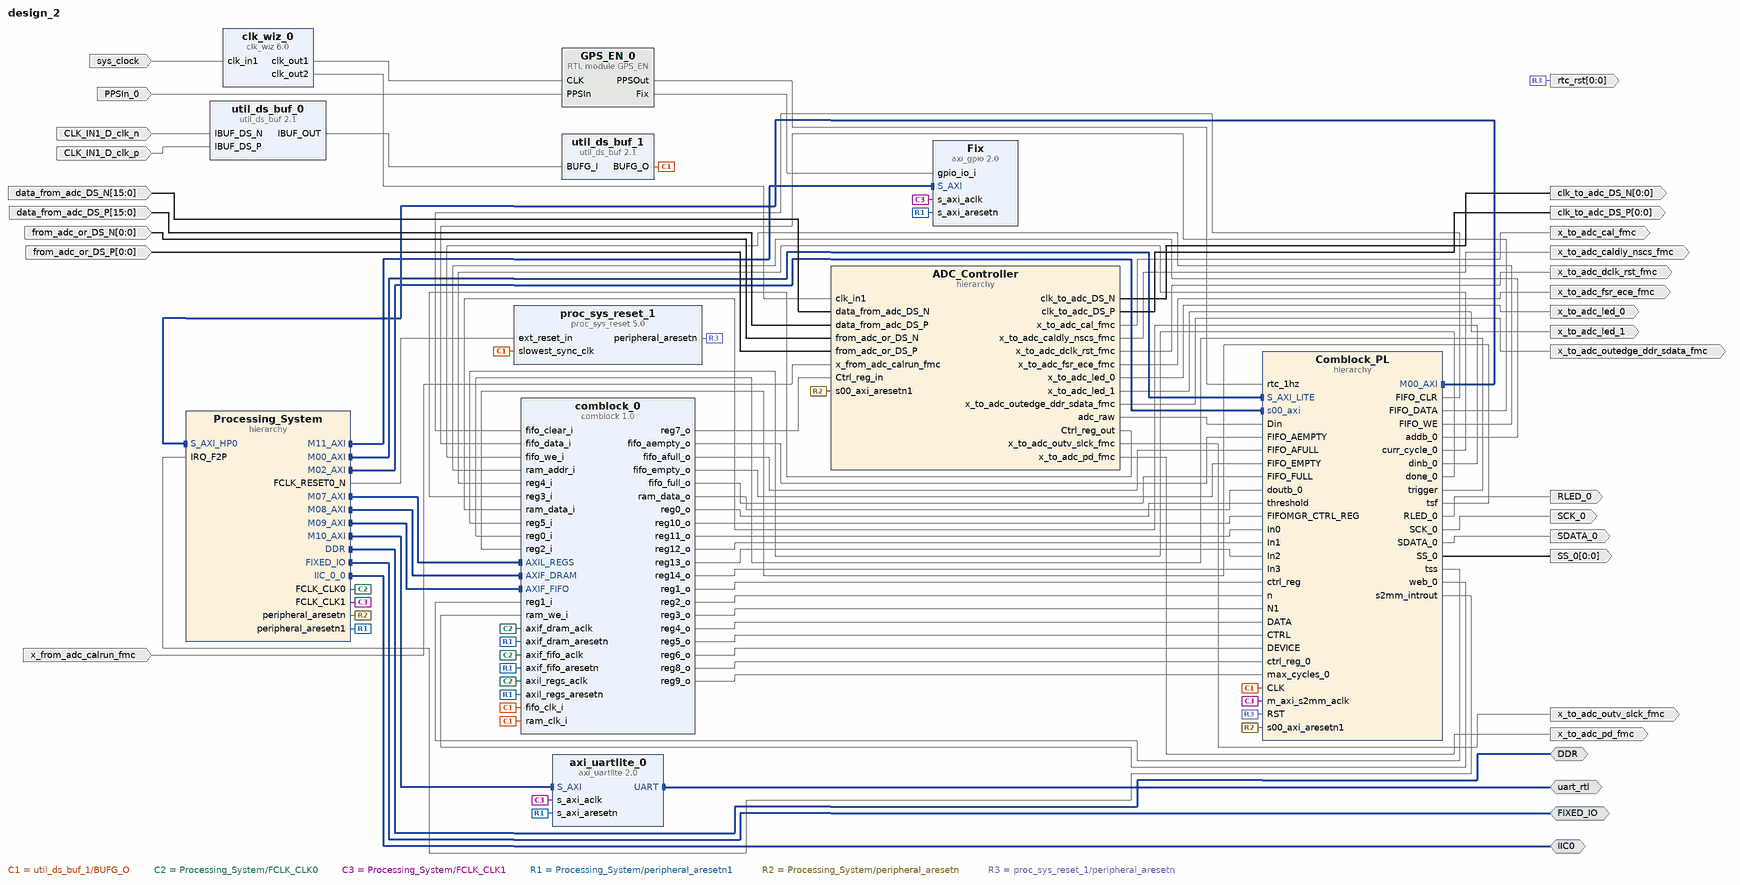
[diagram p0: block diagram of the top level]
# Vivado block design design_2, xc7z020clg484-1, Vivado 2018.2
create_bd_design design_2

create_bd_intf_port -mode Master -vlnv xilinx.com:interface:ddrx_rtl:1.0 DDR
create_bd_intf_port -mode Master -vlnv xilinx.com:display_processing_system7:fixedio_rtl:1.0 FIXED_IO
create_bd_intf_port -mode Master -vlnv xilinx.com:interface:iic_rtl:1.0 IIC0
create_bd_intf_port -mode Master -vlnv xilinx.com:interface:uart_rtl:1.0 uart_rtl
create_bd_port -dir O -from 0 -to 0 clk_to_adc_DS_N
create_bd_port -dir O -from 0 -to 0 clk_to_adc_DS_P
create_bd_port -dir O x_to_adc_cal_fmc
create_bd_port -dir O x_to_adc_caldly_nscs_fmc
create_bd_port -dir O x_to_adc_dclk_rst_fmc
create_bd_port -dir O x_to_adc_fsr_ece_fmc
create_bd_port -dir O x_to_adc_led_0
create_bd_port -dir O x_to_adc_led_1
create_bd_port -dir O x_to_adc_outedge_ddr_sdata_fmc
create_bd_port -dir O x_to_adc_outv_slck_fmc
create_bd_port -dir O x_to_adc_pd_fmc
create_bd_port -dir I -type clk CLK_IN1_D_clk_n
set_property -dict {CONFIG.FREQ_HZ 250000000} [get_bd_ports CLK_IN1_D_clk_n]
create_bd_port -dir I -type clk CLK_IN1_D_clk_p
set_property -dict {CONFIG.FREQ_HZ 250000000} [get_bd_ports CLK_IN1_D_clk_p]
create_bd_port -dir O RLED_0
create_bd_port -dir O SCK_0
create_bd_port -dir O SDATA_0
create_bd_port -dir O -from 0 -to 0 SS_0
create_bd_port -dir I -from 15 -to 0 -type data data_from_adc_DS_N
create_bd_port -dir I -from 15 -to 0 -type data data_from_adc_DS_P
create_bd_port -dir I -from 0 -to 0 from_adc_or_DS_N
create_bd_port -dir I -from 0 -to 0 from_adc_or_DS_P
create_bd_port -dir O -from 0 -to 0 -type rst rtc_rst
create_bd_port -dir I -type clk sys_clock
set_property -dict {CONFIG.FREQ_HZ 100000000 CONFIG.PHASE 0.000} [get_bd_ports sys_clock]
create_bd_port -dir I x_from_adc_calrun_fmc
create_bd_port -dir I PPSIn_0

create_bd_cell -type hier ADC_Controller
create_bd_cell -type hier Comblock_PL
create_bd_cell -type hier Processing_System
create_bd_cell -type ip -vlnv user.org:user:comblock:1.0 comblock_0
set_property -dict {CONFIG.C_FIFO_DATA_WIDTH 32 CONFIG.C_FIFO_DEPTH 1533} [get_bd_cells comblock_0]
create_bd_cell -type ip -vlnv xilinx.com:ip:proc_sys_reset:5.0 proc_sys_reset_1
create_bd_cell -type ip -vlnv xilinx.com:ip:util_ds_buf:2.1 util_ds_buf_0
create_bd_cell -type ip -vlnv xilinx.com:ip:util_ds_buf:2.1 util_ds_buf_1
set_property -dict {CONFIG.C_BUF_TYPE BUFG} [get_bd_cells util_ds_buf_1]
create_bd_cell -type ip -vlnv xilinx.com:ip:axi_uartlite:2.0 axi_uartlite_0
create_bd_cell -type ip -vlnv xilinx.com:ip:axi_gpio:2.0 Fix
set_property -dict [list \
  CONFIG.C_GPIO_WIDTH 1 \
  CONFIG.C_ALL_INPUTS 1 \
  CONFIG.USE_BOARD_FLOW true \
  CONFIG.GPIO_BOARD_INTERFACE Custom \
] [get_bd_cells Fix]
create_bd_cell -type module -reference GPS_EN GPS_EN_0
create_bd_cell -type ip -vlnv xilinx.com:ip:clk_wiz:6.0 clk_wiz_0
set_property -dict [list \
  CONFIG.USE_FREQ_SYNTH false \
  CONFIG.CLKOUT2_USED true \
  CONFIG.NUM_OUT_CLKS 2 \
  CONFIG.USE_LOCKED false \
  CONFIG.USE_RESET false \
  CONFIG.MMCM_DIVCLK_DIVIDE 1 \
  CONFIG.MMCM_CLKOUT1_DIVIDE 10 \
  CONFIG.USE_BOARD_FLOW true \
  CONFIG.CLK_IN1_BOARD_INTERFACE Custom \
  CONFIG.CLKOUT2_JITTER 130.958 \
  CONFIG.CLKOUT2_PHASE_ERROR 98.575 \
] [get_bd_cells clk_wiz_0]

# ---- hierarchy /ADC_Controller ----
current_bd_instance /ADC_Controller
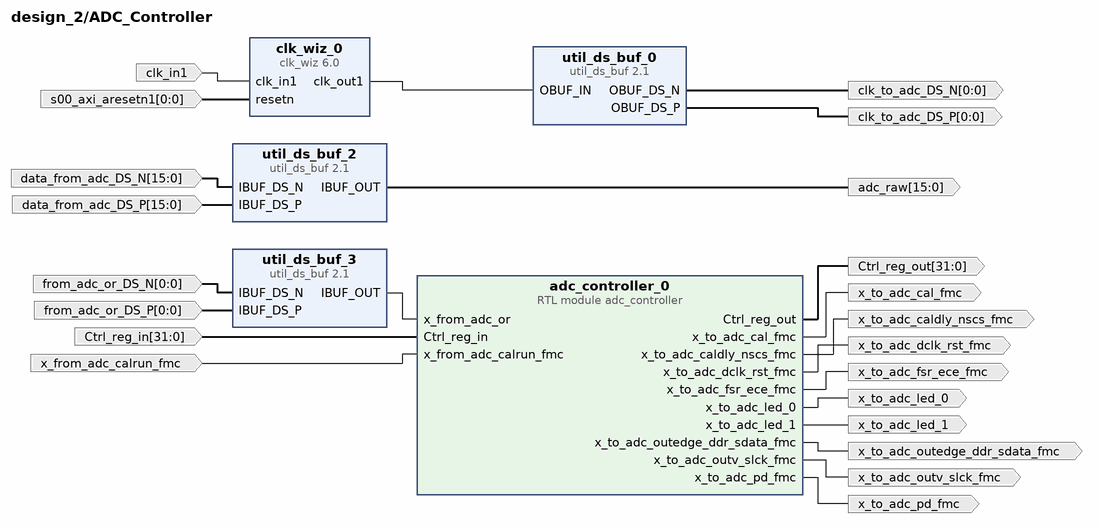
[diagram p1: block diagram inside /ADC_Controller]
create_bd_pin -dir I -from 31 -to 0 Ctrl_reg_in
create_bd_pin -dir O -from 31 -to 0 Ctrl_reg_out
create_bd_pin -dir O -from 15 -to 0 adc_raw
create_bd_pin -dir I -type clk clk_in1
create_bd_pin -dir O -from 0 -to 0 clk_to_adc_DS_N
create_bd_pin -dir O -from 0 -to 0 clk_to_adc_DS_P
create_bd_pin -dir I -from 15 -to 0 data_from_adc_DS_N
create_bd_pin -dir I -from 15 -to 0 data_from_adc_DS_P
create_bd_pin -dir I -from 0 -to 0 from_adc_or_DS_N
create_bd_pin -dir I -from 0 -to 0 from_adc_or_DS_P
create_bd_pin -dir I -from 0 -to 0 -type rst s00_axi_aresetn1
create_bd_pin -dir I x_from_adc_calrun_fmc
create_bd_pin -dir O x_to_adc_cal_fmc
create_bd_pin -dir O x_to_adc_caldly_nscs_fmc
create_bd_pin -dir O x_to_adc_dclk_rst_fmc
create_bd_pin -dir O x_to_adc_fsr_ece_fmc
create_bd_pin -dir O x_to_adc_led_0
create_bd_pin -dir O x_to_adc_led_1
create_bd_pin -dir O x_to_adc_outedge_ddr_sdata_fmc
create_bd_pin -dir O x_to_adc_outv_slck_fmc
create_bd_pin -dir O x_to_adc_pd_fmc

create_bd_cell -type module -reference adc_controller adc_controller_0
create_bd_cell -type ip -vlnv xilinx.com:ip:clk_wiz:6.0 clk_wiz_0
set_property -dict [list \
  CONFIG.CLKOUT1_USED true \
  CONFIG.CLKOUT1_REQUESTED_OUT_FREQ 500 \
  CONFIG.USE_LOCKED false \
  CONFIG.RESET_PORT resetn \
  CONFIG.MMCM_DIVCLK_DIVIDE 1 \
  CONFIG.MMCM_CLKFBOUT_MULT_F 10.000 \
  CONFIG.MMCM_CLKIN1_PERIOD 10.000 \
  CONFIG.MMCM_CLKIN2_PERIOD 10.000 \
  CONFIG.MMCM_CLKOUT0_DIVIDE_F 2.000 \
  CONFIG.RESET_TYPE ACTIVE_LOW \
  CONFIG.USE_BOARD_FLOW true \
  CONFIG.CLK_IN1_BOARD_INTERFACE sys_clock \
  CONFIG.CLKOUT1_JITTER 97.082 \
  CONFIG.CLKOUT1_PHASE_ERROR 98.575 \
] [get_bd_cells clk_wiz_0]
create_bd_cell -type ip -vlnv xilinx.com:ip:util_ds_buf:2.1 util_ds_buf_0
set_property -dict {CONFIG.C_BUF_TYPE OBUFDS} [get_bd_cells util_ds_buf_0]
create_bd_cell -type ip -vlnv xilinx.com:ip:util_ds_buf:2.1 util_ds_buf_2
set_property -dict {CONFIG.C_SIZE 16 CONFIG.C_BUF_TYPE IBUFDS} [get_bd_cells util_ds_buf_2]
create_bd_cell -type ip -vlnv xilinx.com:ip:util_ds_buf:2.1 util_ds_buf_3
set_property -dict {CONFIG.C_BUF_TYPE IBUFDS} [get_bd_cells util_ds_buf_3]

# ---- hierarchy /Comblock_PL ----
current_bd_instance /Comblock_PL
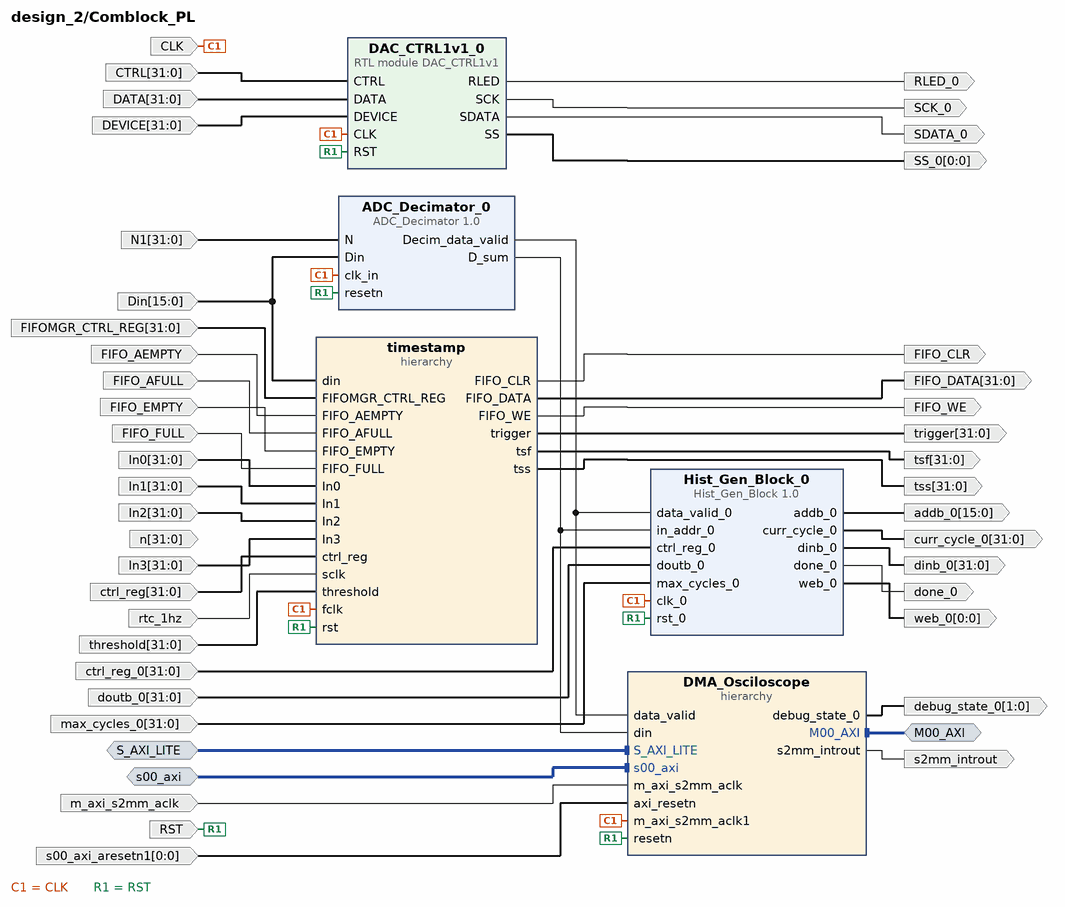
[diagram p2: block diagram inside /Comblock_PL]
create_bd_intf_pin -mode Master -vlnv xilinx.com:interface:aximm_rtl:1.0 M00_AXI
create_bd_intf_pin -mode Slave -vlnv xilinx.com:interface:aximm_rtl:1.0 S_AXI_LITE
create_bd_intf_pin -mode Slave -vlnv xilinx.com:interface:aximm_rtl:1.0 s00_axi
create_bd_pin -dir I -type clk CLK
create_bd_pin -dir I -from 31 -to 0 CTRL
create_bd_pin -dir I -from 31 -to 0 DATA
create_bd_pin -dir I -from 31 -to 0 DEVICE
create_bd_pin -dir I -from 15 -to 0 Din
create_bd_pin -dir I -from 31 -to 0 FIFOMGR_CTRL_REG
create_bd_pin -dir I FIFO_AEMPTY
create_bd_pin -dir I FIFO_AFULL
create_bd_pin -dir O FIFO_CLR
create_bd_pin -dir O -from 31 -to 0 FIFO_DATA
create_bd_pin -dir I FIFO_EMPTY
create_bd_pin -dir I FIFO_FULL
create_bd_pin -dir O FIFO_WE
create_bd_pin -dir I -from 31 -to 0 In0
create_bd_pin -dir I -from 31 -to 0 In1
create_bd_pin -dir I -from 31 -to 0 In2
create_bd_pin -dir I -from 31 -to 0 In3
create_bd_pin -dir I -from 31 -to 0 N1
create_bd_pin -dir O RLED_0
create_bd_pin -dir I -type rst RST
create_bd_pin -dir O SCK_0
create_bd_pin -dir O SDATA_0
create_bd_pin -dir O -from 0 -to 0 SS_0
create_bd_pin -dir O -from 15 -to 0 addb_0
create_bd_pin -dir I -from 31 -to 0 ctrl_reg
create_bd_pin -dir I -from 31 -to 0 ctrl_reg_0
create_bd_pin -dir O -from 31 -to 0 curr_cycle_0
create_bd_pin -dir O -from 1 -to 0 debug_state_0
create_bd_pin -dir O -from 31 -to 0 dinb_0
create_bd_pin -dir O done_0
create_bd_pin -dir I -from 31 -to 0 doutb_0
create_bd_pin -dir I -type clk m_axi_s2mm_aclk
create_bd_pin -dir I -from 31 -to 0 max_cycles_0
create_bd_pin -dir I -from 31 -to 0 n
create_bd_pin -dir I rtc_1hz
create_bd_pin -dir I -from 0 -to 0 -type rst s00_axi_aresetn1
create_bd_pin -dir O -type intr s2mm_introut
create_bd_pin -dir I -from 31 -to 0 threshold
create_bd_pin -dir O -from 31 -to 0 trigger
create_bd_pin -dir O -from 31 -to 0 tsf
create_bd_pin -dir O -from 31 -to 0 tss
create_bd_pin -dir O -from 0 -to 0 web_0

create_bd_cell -type ip -vlnv xilinx.com:user:ADC_Decimator:1.0 ADC_Decimator_0
create_bd_cell -type hier DMA_Osciloscope
create_bd_cell -type ip -vlnv ictp.it:user:Hist_Gen_Block:1.0 Hist_Gen_Block_0
create_bd_cell -type hier timestamp
create_bd_cell -type module -reference DAC_CTRL1v1 DAC_CTRL1v1_0
set_property -dict {CONFIG.NSLAVES 1} [get_bd_cells DAC_CTRL1v1_0]

# ---- hierarchy /Comblock_PL/DMA_Osciloscope ----
current_bd_instance /Comblock_PL/DMA_Osciloscope
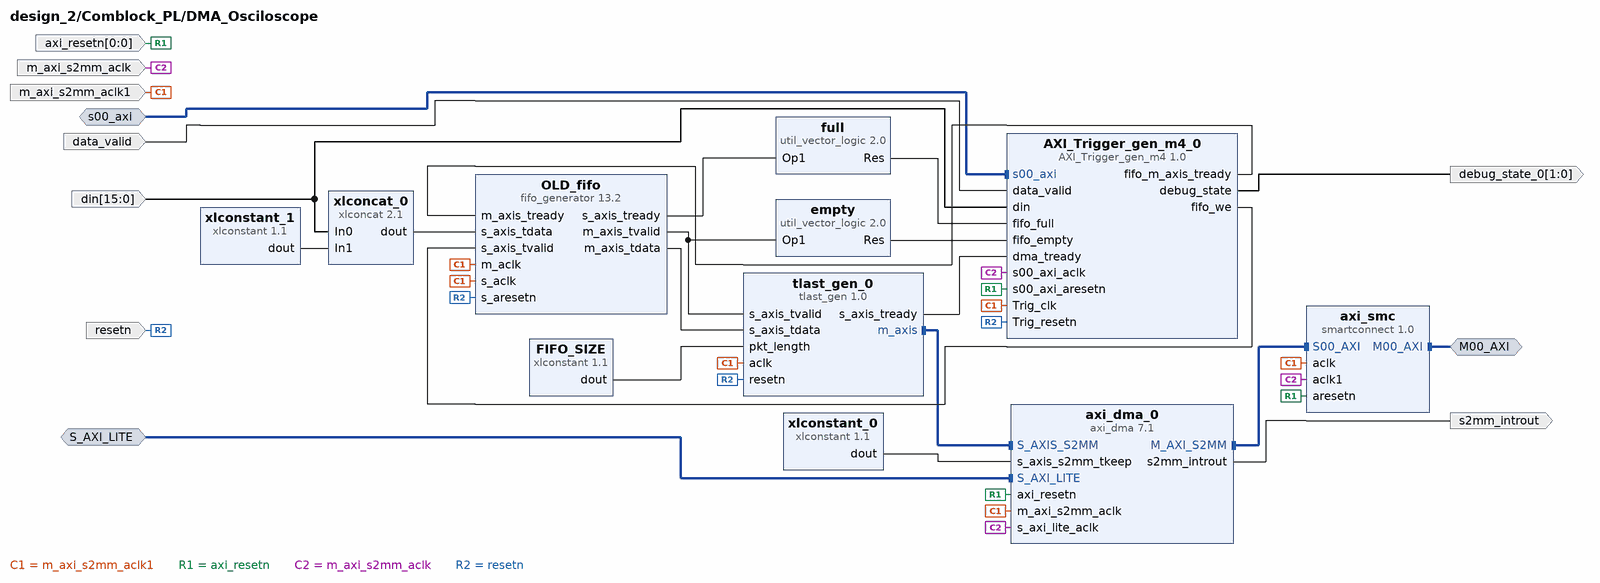
[diagram p3: block diagram inside /Comblock_PL/DMA_Osciloscope]
create_bd_intf_pin -mode Master -vlnv xilinx.com:interface:aximm_rtl:1.0 M00_AXI
create_bd_intf_pin -mode Slave -vlnv xilinx.com:interface:aximm_rtl:1.0 S_AXI_LITE
create_bd_intf_pin -mode Slave -vlnv xilinx.com:interface:aximm_rtl:1.0 s00_axi
create_bd_pin -dir I -from 0 -to 0 -type rst axi_resetn
create_bd_pin -dir I data_valid
create_bd_pin -dir O -from 1 -to 0 debug_state_0
create_bd_pin -dir I -from 15 -to 0 din
create_bd_pin -dir I -type clk m_axi_s2mm_aclk
create_bd_pin -dir I -type clk m_axi_s2mm_aclk1
create_bd_pin -dir I -type rst resetn
create_bd_pin -dir O -type intr s2mm_introut

create_bd_cell -type ip -vlnv xilinx.com:user:AXI_Trigger_gen_m4:1.0 AXI_Trigger_gen_m4_0
create_bd_cell -type ip -vlnv xilinx.com:ip:xlconstant:1.1 FIFO_SIZE
set_property -dict {CONFIG.CONST_WIDTH 32 CONFIG.CONST_VAL 32768} [get_bd_cells FIFO_SIZE]
create_bd_cell -type ip -vlnv xilinx.com:ip:fifo_generator:13.2 OLD_fifo
set_property -dict [list \
  CONFIG.INTERFACE_TYPE AXI_STREAM \
  CONFIG.Full_Flags_Reset_Value 1 \
  CONFIG.Clock_Type_AXI Independent_Clock \
  CONFIG.TDATA_NUM_BYTES 4 \
  CONFIG.TUSER_WIDTH 0 \
  CONFIG.FIFO_Implementation_wach Independent_Clocks_Distributed_RAM \
  CONFIG.FIFO_Implementation_wdch Independent_Clocks_Block_RAM \
  CONFIG.FIFO_Implementation_wrch Independent_Clocks_Distributed_RAM \
  CONFIG.FIFO_Implementation_rach Independent_Clocks_Distributed_RAM \
  CONFIG.FIFO_Implementation_rdch Independent_Clocks_Block_RAM \
  CONFIG.FIFO_Implementation_axis Independent_Clocks_Block_RAM \
  CONFIG.Input_Depth_axis 32768 \
  CONFIG.Enable_Data_Counts_axis false \
  CONFIG.Programmable_Full_Type_axis Single_Programmable_Full_Threshold_Constant \
  CONFIG.Full_Threshold_Assert_Value_axis 32767 \
  CONFIG.Programmable_Empty_Type_axis Single_Programmable_Empty_Threshold_Constant \
  CONFIG.Empty_Threshold_Assert_Value_axis 4 \
] [get_bd_cells OLD_fifo]
create_bd_cell -type ip -vlnv xilinx.com:ip:util_vector_logic:2.0 empty
set_property -dict {CONFIG.C_SIZE 1 CONFIG.C_OPERATION not} [get_bd_cells empty]
create_bd_cell -type ip -vlnv xilinx.com:ip:util_vector_logic:2.0 full
set_property -dict {CONFIG.C_SIZE 1 CONFIG.C_OPERATION not} [get_bd_cells full]
create_bd_cell -type ip -vlnv xilinx.com:user:tlast_gen:1.0 tlast_gen_0
set_property -dict {CONFIG.TDATA_WIDTH 32 CONFIG.MAX_PKT_LENGTH 2147483647} [get_bd_cells tlast_gen_0]
create_bd_cell -type ip -vlnv xilinx.com:ip:xlconcat:2.1 xlconcat_0
set_property -dict {CONFIG.IN0_WIDTH 16 CONFIG.IN1_WIDTH 16} [get_bd_cells xlconcat_0]
create_bd_cell -type ip -vlnv xilinx.com:ip:xlconstant:1.1 xlconstant_0
set_property -dict {CONFIG.CONST_WIDTH 4 CONFIG.CONST_VAL 15} [get_bd_cells xlconstant_0]
create_bd_cell -type ip -vlnv xilinx.com:ip:xlconstant:1.1 xlconstant_1
set_property -dict {CONFIG.CONST_WIDTH 16 CONFIG.CONST_VAL 0} [get_bd_cells xlconstant_1]
create_bd_cell -type ip -vlnv xilinx.com:ip:axi_dma:7.1 axi_dma_0
set_property -dict [list \
  CONFIG.c_include_sg 0 \
  CONFIG.c_sg_length_width 23 \
  CONFIG.c_include_mm2s 0 \
  CONFIG.c_include_s2mm 1 \
  CONFIG.c_m_axi_s2mm_data_width 64 \
  CONFIG.c_include_s2mm_dre 1 \
  CONFIG.c_s2mm_burst_size 256 \
] [get_bd_cells axi_dma_0]
create_bd_cell -type ip -vlnv xilinx.com:ip:smartconnect:1.0 axi_smc
set_property -dict {CONFIG.NUM_SI 1 CONFIG.NUM_CLKS 2} [get_bd_cells axi_smc]

# ---- hierarchy /Comblock_PL/timestamp ----
current_bd_instance /Comblock_PL/timestamp
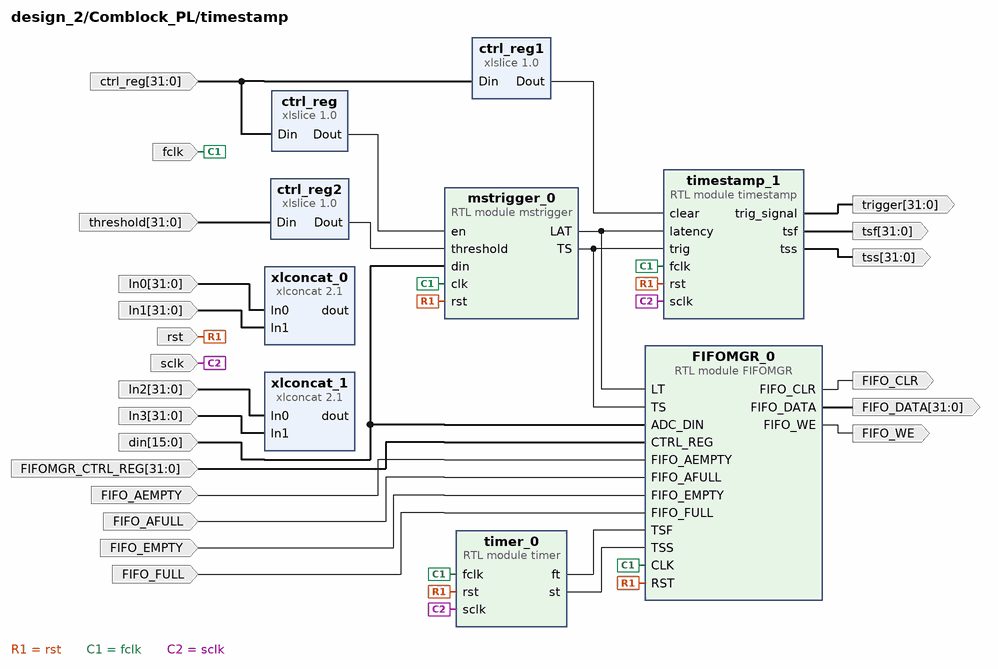
[diagram p4: block diagram inside /Comblock_PL/timestamp]
create_bd_pin -dir I -from 31 -to 0 FIFOMGR_CTRL_REG
create_bd_pin -dir I FIFO_AEMPTY
create_bd_pin -dir I FIFO_AFULL
create_bd_pin -dir O FIFO_CLR
create_bd_pin -dir O -from 31 -to 0 FIFO_DATA
create_bd_pin -dir I FIFO_EMPTY
create_bd_pin -dir I FIFO_FULL
create_bd_pin -dir O FIFO_WE
create_bd_pin -dir I -from 31 -to 0 In0
create_bd_pin -dir I -from 31 -to 0 In1
create_bd_pin -dir I -from 31 -to 0 In2
create_bd_pin -dir I -from 31 -to 0 In3
create_bd_pin -dir I -from 31 -to 0 ctrl_reg
create_bd_pin -dir I -from 15 -to 0 din
create_bd_pin -dir I fclk
create_bd_pin -dir I -type rst rst
create_bd_pin -dir I sclk
create_bd_pin -dir I -from 31 -to 0 threshold
create_bd_pin -dir O -from 31 -to 0 trigger
create_bd_pin -dir O -from 31 -to 0 tsf
create_bd_pin -dir O -from 31 -to 0 tss

create_bd_cell -type module -reference FIFOMGR FIFOMGR_0
create_bd_cell -type ip -vlnv xilinx.com:ip:xlslice:1.0 ctrl_reg
create_bd_cell -type ip -vlnv xilinx.com:ip:xlslice:1.0 ctrl_reg1
set_property -dict {CONFIG.DIN_TO 1 CONFIG.DIN_FROM 1 CONFIG.DOUT_WIDTH 1} [get_bd_cells ctrl_reg1]
create_bd_cell -type ip -vlnv xilinx.com:ip:xlslice:1.0 ctrl_reg2
set_property -dict {CONFIG.DIN_TO 0 CONFIG.DIN_FROM 7 CONFIG.DOUT_WIDTH 8} [get_bd_cells ctrl_reg2]
create_bd_cell -type module -reference mstrigger mstrigger_0
create_bd_cell -type module -reference timer timer_0
create_bd_cell -type module -reference timestamp timestamp_1
create_bd_cell -type ip -vlnv xilinx.com:ip:xlconcat:2.1 xlconcat_0
create_bd_cell -type ip -vlnv xilinx.com:ip:xlconcat:2.1 xlconcat_1

# ---- hierarchy /Processing_System ----
current_bd_instance /Processing_System
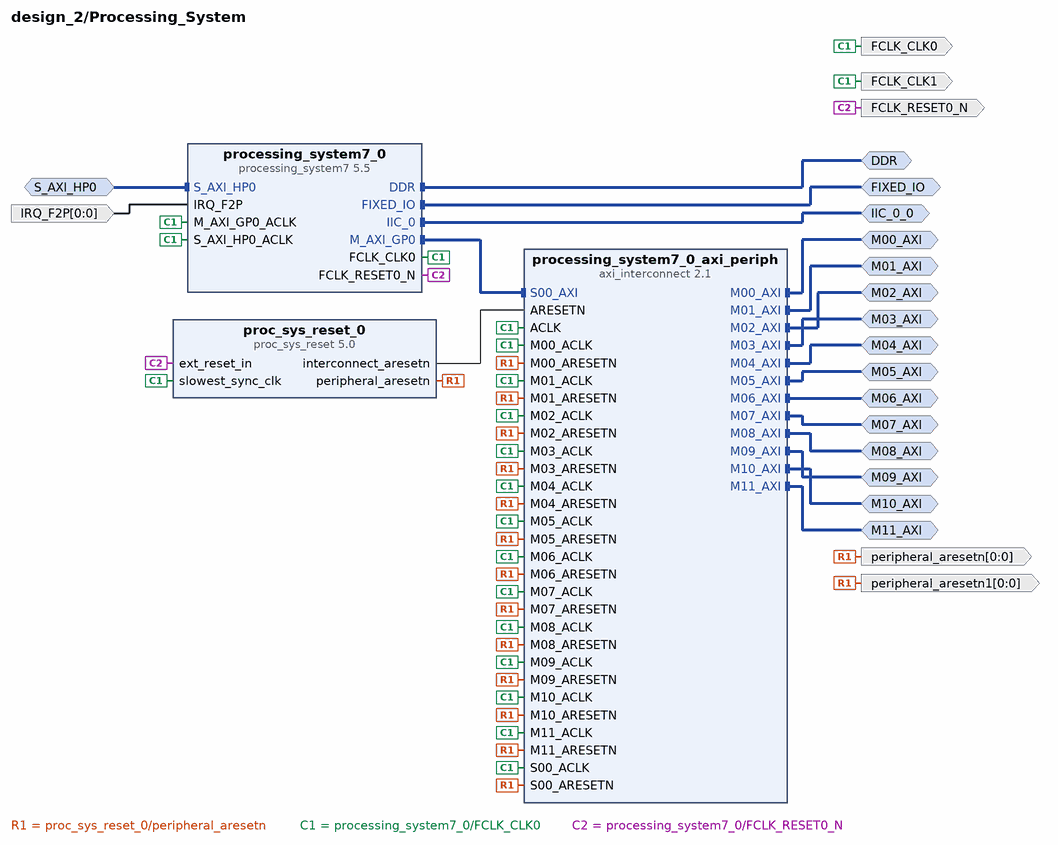
[diagram p5: block diagram inside /Processing_System]
create_bd_intf_pin -mode Master -vlnv xilinx.com:interface:ddrx_rtl:1.0 DDR
create_bd_intf_pin -mode Master -vlnv xilinx.com:display_processing_system7:fixedio_rtl:1.0 FIXED_IO
create_bd_intf_pin -mode Master -vlnv xilinx.com:interface:iic_rtl:1.0 IIC_0_0
create_bd_intf_pin -mode Master -vlnv xilinx.com:interface:aximm_rtl:1.0 M00_AXI
create_bd_intf_pin -mode Master -vlnv xilinx.com:interface:aximm_rtl:1.0 M01_AXI
create_bd_intf_pin -mode Master -vlnv xilinx.com:interface:aximm_rtl:1.0 M02_AXI
create_bd_intf_pin -mode Master -vlnv xilinx.com:interface:aximm_rtl:1.0 M03_AXI
create_bd_intf_pin -mode Master -vlnv xilinx.com:interface:aximm_rtl:1.0 M04_AXI
create_bd_intf_pin -mode Master -vlnv xilinx.com:interface:aximm_rtl:1.0 M05_AXI
create_bd_intf_pin -mode Master -vlnv xilinx.com:interface:aximm_rtl:1.0 M06_AXI
create_bd_intf_pin -mode Master -vlnv xilinx.com:interface:aximm_rtl:1.0 M07_AXI
create_bd_intf_pin -mode Master -vlnv xilinx.com:interface:aximm_rtl:1.0 M08_AXI
create_bd_intf_pin -mode Master -vlnv xilinx.com:interface:aximm_rtl:1.0 M09_AXI
create_bd_intf_pin -mode Slave -vlnv xilinx.com:interface:aximm_rtl:1.0 S_AXI_HP0
create_bd_intf_pin -mode Master -vlnv xilinx.com:interface:aximm_rtl:1.0 M10_AXI
create_bd_intf_pin -mode Master -vlnv xilinx.com:interface:aximm_rtl:1.0 M11_AXI
create_bd_pin -dir O FCLK_CLK0
create_bd_pin -dir O FCLK_CLK1
create_bd_pin -dir O -type rst FCLK_RESET0_N
create_bd_pin -dir I -from 0 -to 0 -type intr IRQ_F2P
create_bd_pin -dir O -from 0 -to 0 peripheral_aresetn
create_bd_pin -dir O -from 0 -to 0 peripheral_aresetn1

create_bd_cell -type ip -vlnv xilinx.com:ip:proc_sys_reset:5.0 proc_sys_reset_0
create_bd_cell -type ip -vlnv xilinx.com:ip:processing_system7:5.5 processing_system7_0
set_property -dict [list \
  CONFIG.PCW_FCLK_CLK1_BUF TRUE \
  CONFIG.PCW_UIPARAM_DDR_FREQ_MHZ 533.333313 \
  CONFIG.PCW_APU_PERIPHERAL_FREQMHZ 666.666667 \
  CONFIG.PCW_SDIO_PERIPHERAL_FREQMHZ 50 \
  CONFIG.PCW_UART_PERIPHERAL_FREQMHZ 50 \
  CONFIG.PCW_I2C_PERIPHERAL_FREQMHZ 111.111115 \
  CONFIG.PCW_FPGA0_PERIPHERAL_FREQMHZ 50 \
  CONFIG.PCW_FPGA1_PERIPHERAL_FREQMHZ 100 \
  CONFIG.PCW_USE_S_AXI_HP0 1 \
  CONFIG.PCW_USE_FABRIC_INTERRUPT 1 \
  CONFIG.PCW_EN_CLK1_PORT 1 \
  CONFIG.PCW_IRQ_F2P_INTR 1 \
  CONFIG.PCW_GP0_EN_MODIFIABLE_TXN 0 \
  CONFIG.PCW_GP1_EN_MODIFIABLE_TXN 0 \
  CONFIG.PCW_PERIPHERAL_BOARD_PRESET part0 \
  CONFIG.PCW_PRESET_BANK1_VOLTAGE {LVCMOS 1.8V} \
  CONFIG.PCW_UIPARAM_DDR_PARTNO {MT41J128M16 HA-15E} \
  CONFIG.PCW_QSPI_PERIPHERAL_ENABLE 1 \
  CONFIG.PCW_QSPI_QSPI_IO {MIO 1 .. 6} \
  CONFIG.PCW_QSPI_GRP_SINGLE_SS_ENABLE 1 \
  CONFIG.PCW_QSPI_GRP_SINGLE_SS_IO {MIO 1 .. 6} \
  CONFIG.PCW_SINGLE_QSPI_DATA_MODE x4 \
  CONFIG.PCW_ENET0_PERIPHERAL_ENABLE 1 \
  CONFIG.PCW_ENET0_ENET0_IO {MIO 16 .. 27} \
  CONFIG.PCW_ENET0_GRP_MDIO_ENABLE 1 \
  CONFIG.PCW_ENET0_GRP_MDIO_IO {MIO 52 .. 53} \
  CONFIG.PCW_ENET_RESET_ENABLE 1 \
  CONFIG.PCW_ENET_RESET_SELECT {Share reset pin} \
  CONFIG.PCW_ENET0_RESET_ENABLE 0 \
  CONFIG.PCW_SD0_PERIPHERAL_ENABLE 1 \
  CONFIG.PCW_SD0_SD0_IO {MIO 40 .. 45} \
  CONFIG.PCW_SD0_GRP_CD_ENABLE 1 \
  CONFIG.PCW_SD0_GRP_CD_IO {MIO 47} \
  CONFIG.PCW_SD0_GRP_WP_ENABLE 1 \
  CONFIG.PCW_SD0_GRP_WP_IO {MIO 46} \
  CONFIG.PCW_UART1_PERIPHERAL_ENABLE 1 \
  CONFIG.PCW_UART1_UART1_IO {MIO 48 .. 49} \
  CONFIG.PCW_USB0_PERIPHERAL_ENABLE 1 \
  CONFIG.PCW_USB0_USB0_IO {MIO 28 .. 39} \
  CONFIG.PCW_USB_RESET_ENABLE 1 \
  CONFIG.PCW_USB_RESET_SELECT {Share reset pin} \
  CONFIG.PCW_USB0_RESET_ENABLE 0 \
  CONFIG.PCW_I2C0_PERIPHERAL_ENABLE 1 \
  CONFIG.PCW_I2C0_I2C0_IO EMIO \
  CONFIG.PCW_I2C_RESET_ENABLE 1 \
  CONFIG.PCW_I2C_RESET_SELECT {Share reset pin} \
  CONFIG.PCW_GPIO_MIO_GPIO_ENABLE 1 \
  CONFIG.PCW_GPIO_MIO_GPIO_IO MIO \
  CONFIG.preset ZedBoard \
  CONFIG.PCW_FPGA_FCLK1_ENABLE 1 \
] [get_bd_cells processing_system7_0]
# 511 more settings of processing_system7_0 are not shown: defaults, MIO pin electricals, DDR timing, and values the tool derives
create_bd_cell -type ip -vlnv xilinx.com:ip:axi_interconnect:2.1 processing_system7_0_axi_periph
set_property -dict {CONFIG.NUM_MI 12 CONFIG.SYNCHRONIZATION_STAGES 2} [get_bd_cells processing_system7_0_axi_periph]

# ---- connections ----

current_bd_instance /ADC_Controller
connect_bd_net [get_bd_pins Ctrl_reg_in] [get_bd_pins adc_controller_0/Ctrl_reg_in]
connect_bd_net -net IBUF_DS_N1_1 [get_bd_pins from_adc_or_DS_N] [get_bd_pins util_ds_buf_3/IBUF_DS_N]
connect_bd_net -net IBUF_DS_N_2 [get_bd_pins data_from_adc_DS_N] [get_bd_pins util_ds_buf_2/IBUF_DS_N]
connect_bd_net -net IBUF_DS_P1_1 [get_bd_pins from_adc_or_DS_P] [get_bd_pins util_ds_buf_3/IBUF_DS_P]
connect_bd_net -net IBUF_DS_P_2 [get_bd_pins data_from_adc_DS_P] [get_bd_pins util_ds_buf_2/IBUF_DS_P]
connect_bd_net [get_bd_pins adc_controller_0/Ctrl_reg_out] [get_bd_pins Ctrl_reg_out]
connect_bd_net [get_bd_pins adc_controller_0/x_to_adc_cal_fmc] [get_bd_pins x_to_adc_cal_fmc]
connect_bd_net [get_bd_pins adc_controller_0/x_to_adc_caldly_nscs_fmc] [get_bd_pins x_to_adc_caldly_nscs_fmc]
connect_bd_net [get_bd_pins adc_controller_0/x_to_adc_dclk_rst_fmc] [get_bd_pins x_to_adc_dclk_rst_fmc]
connect_bd_net [get_bd_pins adc_controller_0/x_to_adc_fsr_ece_fmc] [get_bd_pins x_to_adc_fsr_ece_fmc]
connect_bd_net [get_bd_pins adc_controller_0/x_to_adc_led_0] [get_bd_pins x_to_adc_led_0]
connect_bd_net [get_bd_pins adc_controller_0/x_to_adc_led_1] [get_bd_pins x_to_adc_led_1]
connect_bd_net [get_bd_pins adc_controller_0/x_to_adc_outedge_ddr_sdata_fmc] [get_bd_pins x_to_adc_outedge_ddr_sdata_fmc]
connect_bd_net [get_bd_pins adc_controller_0/x_to_adc_outv_slck_fmc] [get_bd_pins x_to_adc_outv_slck_fmc]
connect_bd_net [get_bd_pins adc_controller_0/x_to_adc_pd_fmc] [get_bd_pins x_to_adc_pd_fmc]
connect_bd_net -net clk_in1_1 [get_bd_pins clk_in1] [get_bd_pins clk_wiz_0/clk_in1]
connect_bd_net [get_bd_pins clk_wiz_0/clk_out1] [get_bd_pins util_ds_buf_0/OBUF_IN]
connect_bd_net -net s00_axi_aresetn1_1 [get_bd_pins s00_axi_aresetn1] [get_bd_pins clk_wiz_0/resetn]
connect_bd_net [get_bd_pins util_ds_buf_0/OBUF_DS_N] [get_bd_pins clk_to_adc_DS_N]
connect_bd_net [get_bd_pins util_ds_buf_0/OBUF_DS_P] [get_bd_pins clk_to_adc_DS_P]
connect_bd_net [get_bd_pins util_ds_buf_2/IBUF_OUT] [get_bd_pins adc_raw]
connect_bd_net [get_bd_pins util_ds_buf_3/IBUF_OUT] [get_bd_pins adc_controller_0/x_from_adc_or]
connect_bd_net [get_bd_pins x_from_adc_calrun_fmc] [get_bd_pins adc_controller_0/x_from_adc_calrun_fmc]

current_bd_instance /Comblock_PL
connect_bd_intf_net [get_bd_intf_pins M00_AXI] [get_bd_intf_pins DMA_Osciloscope/M00_AXI]
connect_bd_intf_net [get_bd_intf_pins S_AXI_LITE] [get_bd_intf_pins DMA_Osciloscope/S_AXI_LITE]
connect_bd_intf_net [get_bd_intf_pins s00_axi] [get_bd_intf_pins DMA_Osciloscope/s00_axi]
connect_bd_net [get_bd_pins CLK] \
  [get_bd_pins ADC_Decimator_0/clk_in] [get_bd_pins Hist_Gen_Block_0/clk_0] [get_bd_pins DAC_CTRL1v1_0/CLK] \
  [get_bd_pins DMA_Osciloscope/m_axi_s2mm_aclk1] [get_bd_pins timestamp/fclk]
connect_bd_net [get_bd_pins CTRL] [get_bd_pins DAC_CTRL1v1_0/CTRL]
connect_bd_net [get_bd_pins DAC_CTRL1v1_0/RLED] [get_bd_pins RLED_0]
connect_bd_net [get_bd_pins DAC_CTRL1v1_0/SCK] [get_bd_pins SCK_0]
connect_bd_net [get_bd_pins DAC_CTRL1v1_0/SDATA] [get_bd_pins SDATA_0]
connect_bd_net [get_bd_pins DAC_CTRL1v1_0/SS] [get_bd_pins SS_0]
connect_bd_net [get_bd_pins DATA] [get_bd_pins DAC_CTRL1v1_0/DATA]
connect_bd_net [get_bd_pins DEVICE] [get_bd_pins DAC_CTRL1v1_0/DEVICE]
connect_bd_net [get_bd_pins DMA_Osciloscope/debug_state_0] [get_bd_pins debug_state_0]
connect_bd_net [get_bd_pins DMA_Osciloscope/s2mm_introut] [get_bd_pins s2mm_introut]
connect_bd_net [get_bd_pins Din] [get_bd_pins ADC_Decimator_0/Din] [get_bd_pins timestamp/din]
connect_bd_net [get_bd_pins FIFOMGR_CTRL_REG] [get_bd_pins timestamp/FIFOMGR_CTRL_REG]
connect_bd_net [get_bd_pins FIFO_AEMPTY] [get_bd_pins timestamp/FIFO_AEMPTY]
connect_bd_net [get_bd_pins FIFO_AFULL] [get_bd_pins timestamp/FIFO_AFULL]
connect_bd_net [get_bd_pins FIFO_EMPTY] [get_bd_pins timestamp/FIFO_EMPTY]
connect_bd_net [get_bd_pins FIFO_FULL] [get_bd_pins timestamp/FIFO_FULL]
connect_bd_net [get_bd_pins Hist_Gen_Block_0/addb_0] [get_bd_pins addb_0]
connect_bd_net [get_bd_pins Hist_Gen_Block_0/curr_cycle_0] [get_bd_pins curr_cycle_0]
connect_bd_net [get_bd_pins Hist_Gen_Block_0/dinb_0] [get_bd_pins dinb_0]
connect_bd_net [get_bd_pins Hist_Gen_Block_0/done_0] [get_bd_pins done_0]
connect_bd_net [get_bd_pins Hist_Gen_Block_0/web_0] [get_bd_pins web_0]
connect_bd_net -net In0_1 [get_bd_pins In0] [get_bd_pins timestamp/In0]
connect_bd_net -net In1_1 [get_bd_pins In1] [get_bd_pins timestamp/In1]
connect_bd_net -net In2_1 [get_bd_pins In2] [get_bd_pins timestamp/In2]
connect_bd_net -net In3_1 [get_bd_pins In3] [get_bd_pins timestamp/In3]
connect_bd_net -net N1_1 [get_bd_pins N1] [get_bd_pins ADC_Decimator_0/N]
connect_bd_net -net ctrl_reg_0_1 [get_bd_pins ctrl_reg_0] [get_bd_pins Hist_Gen_Block_0/ctrl_reg_0]
connect_bd_net [get_bd_pins ctrl_reg] [get_bd_pins timestamp/ctrl_reg]
connect_bd_net -net data_valid_1 [get_bd_pins ADC_Decimator_0/Decim_data_valid] \
  [get_bd_pins Hist_Gen_Block_0/data_valid_0] [get_bd_pins DMA_Osciloscope/data_valid]
connect_bd_net -net din_2 [get_bd_pins ADC_Decimator_0/D_sum] [get_bd_pins Hist_Gen_Block_0/in_addr_0] [get_bd_pins DMA_Osciloscope/din]
connect_bd_net -net doutb_0_1 [get_bd_pins doutb_0] [get_bd_pins Hist_Gen_Block_0/doutb_0]
connect_bd_net [get_bd_pins m_axi_s2mm_aclk] [get_bd_pins DMA_Osciloscope/m_axi_s2mm_aclk]
connect_bd_net -net max_cycles_0_1 [get_bd_pins max_cycles_0] [get_bd_pins Hist_Gen_Block_0/max_cycles_0]
connect_bd_net -net proc_sys_reset_0_peripheral_aresetn [get_bd_pins s00_axi_aresetn1] [get_bd_pins DMA_Osciloscope/axi_resetn]
connect_bd_net -net proc_sys_reset_1_peripheral_aresetn [get_bd_pins RST] \
  [get_bd_pins ADC_Decimator_0/resetn] [get_bd_pins Hist_Gen_Block_0/rst_0] [get_bd_pins DAC_CTRL1v1_0/RST] \
  [get_bd_pins DMA_Osciloscope/resetn] [get_bd_pins timestamp/rst]
connect_bd_net [get_bd_pins rtc_1hz] [get_bd_pins timestamp/sclk]
connect_bd_net [get_bd_pins threshold] [get_bd_pins timestamp/threshold]
connect_bd_net [get_bd_pins timestamp/FIFO_CLR] [get_bd_pins FIFO_CLR]
connect_bd_net [get_bd_pins timestamp/FIFO_DATA] [get_bd_pins FIFO_DATA]
connect_bd_net [get_bd_pins timestamp/FIFO_WE] [get_bd_pins FIFO_WE]
connect_bd_net [get_bd_pins timestamp/trigger] [get_bd_pins trigger]
connect_bd_net [get_bd_pins timestamp/tsf] [get_bd_pins tsf]
connect_bd_net [get_bd_pins timestamp/tss] [get_bd_pins tss]

current_bd_instance /Comblock_PL/DMA_Osciloscope
connect_bd_intf_net [get_bd_intf_pins axi_dma_0/M_AXI_S2MM] [get_bd_intf_pins axi_smc/S00_AXI]
connect_bd_intf_net [get_bd_intf_pins axi_dma_0/S_AXIS_S2MM] [get_bd_intf_pins tlast_gen_0/m_axis]
connect_bd_intf_net [get_bd_intf_pins M00_AXI] [get_bd_intf_pins axi_smc/M00_AXI]
connect_bd_intf_net [get_bd_intf_pins S_AXI_LITE] [get_bd_intf_pins axi_dma_0/S_AXI_LITE]
connect_bd_intf_net [get_bd_intf_pins s00_axi] [get_bd_intf_pins AXI_Trigger_gen_m4_0/s00_axi]
connect_bd_net [get_bd_pins AXI_Trigger_gen_m4_0/debug_state] [get_bd_pins debug_state_0]
connect_bd_net [get_bd_pins AXI_Trigger_gen_m4_0/fifo_m_axis_tready] [get_bd_pins OLD_fifo/m_axis_tready]
connect_bd_net [get_bd_pins AXI_Trigger_gen_m4_0/fifo_we] [get_bd_pins OLD_fifo/s_axis_tvalid]
connect_bd_net [get_bd_pins m_axi_s2mm_aclk1] \
  [get_bd_pins AXI_Trigger_gen_m4_0/Trig_clk] [get_bd_pins OLD_fifo/m_aclk] [get_bd_pins OLD_fifo/s_aclk] \
  [get_bd_pins tlast_gen_0/aclk] [get_bd_pins axi_dma_0/m_axi_s2mm_aclk] [get_bd_pins axi_smc/aclk]
connect_bd_net [get_bd_pins OLD_fifo/m_axis_tdata] [get_bd_pins tlast_gen_0/s_axis_tdata]
connect_bd_net [get_bd_pins OLD_fifo/m_axis_tvalid] [get_bd_pins empty/Op1] [get_bd_pins tlast_gen_0/s_axis_tvalid]
connect_bd_net [get_bd_pins OLD_fifo/s_axis_tready] [get_bd_pins full/Op1]
connect_bd_net [get_bd_pins axi_dma_0/s2mm_introut] [get_bd_pins s2mm_introut]
connect_bd_net [get_bd_pins data_valid] [get_bd_pins AXI_Trigger_gen_m4_0/data_valid]
connect_bd_net [get_bd_pins din] [get_bd_pins AXI_Trigger_gen_m4_0/din] [get_bd_pins xlconcat_0/In0]
connect_bd_net [get_bd_pins empty/Res] [get_bd_pins AXI_Trigger_gen_m4_0/fifo_empty]
connect_bd_net [get_bd_pins full/Res] [get_bd_pins AXI_Trigger_gen_m4_0/fifo_full]
connect_bd_net -net proc_sys_reset_0_peripheral_aresetn [get_bd_pins axi_resetn] \
  [get_bd_pins AXI_Trigger_gen_m4_0/s00_axi_aresetn] [get_bd_pins axi_dma_0/axi_resetn] [get_bd_pins axi_smc/aresetn]
connect_bd_net -net processing_system7_0_FCLK_CLK0 [get_bd_pins m_axi_s2mm_aclk] \
  [get_bd_pins AXI_Trigger_gen_m4_0/s00_axi_aclk] [get_bd_pins axi_dma_0/s_axi_lite_aclk] [get_bd_pins axi_smc/aclk1]
connect_bd_net [get_bd_pins resetn] [get_bd_pins AXI_Trigger_gen_m4_0/Trig_resetn] [get_bd_pins OLD_fifo/s_aresetn] [get_bd_pins tlast_gen_0/resetn]
connect_bd_net [get_bd_pins tlast_gen_0/s_axis_tready] [get_bd_pins AXI_Trigger_gen_m4_0/dma_tready]
connect_bd_net [get_bd_pins xlconcat_0/dout] [get_bd_pins OLD_fifo/s_axis_tdata]
connect_bd_net [get_bd_pins xlconstant_0/dout] [get_bd_pins axi_dma_0/s_axis_s2mm_tkeep]
connect_bd_net -net xlconstant_1_dout [get_bd_pins FIFO_SIZE/dout] [get_bd_pins tlast_gen_0/pkt_length]
connect_bd_net [get_bd_pins xlconstant_1/dout] [get_bd_pins xlconcat_0/In1]

current_bd_instance /Comblock_PL/timestamp
connect_bd_net [get_bd_pins FIFOMGR_0/FIFO_CLR] [get_bd_pins FIFO_CLR]
connect_bd_net [get_bd_pins FIFOMGR_0/FIFO_DATA] [get_bd_pins FIFO_DATA]
connect_bd_net [get_bd_pins FIFOMGR_0/FIFO_WE] [get_bd_pins FIFO_WE]
connect_bd_net [get_bd_pins FIFOMGR_CTRL_REG] [get_bd_pins FIFOMGR_0/CTRL_REG]
connect_bd_net [get_bd_pins FIFO_AEMPTY] [get_bd_pins FIFOMGR_0/FIFO_AEMPTY]
connect_bd_net [get_bd_pins FIFO_AFULL] [get_bd_pins FIFOMGR_0/FIFO_AFULL]
connect_bd_net [get_bd_pins FIFO_EMPTY] [get_bd_pins FIFOMGR_0/FIFO_EMPTY]
connect_bd_net [get_bd_pins FIFO_FULL] [get_bd_pins FIFOMGR_0/FIFO_FULL]
connect_bd_net -net In0_1 [get_bd_pins In0] [get_bd_pins xlconcat_0/In0]
connect_bd_net -net In1_1 [get_bd_pins In1] [get_bd_pins xlconcat_0/In1]
connect_bd_net -net In2_1 [get_bd_pins In2] [get_bd_pins xlconcat_1/In0]
connect_bd_net -net In3_1 [get_bd_pins In3] [get_bd_pins xlconcat_1/In1]
connect_bd_net [get_bd_pins rst] [get_bd_pins FIFOMGR_0/RST] [get_bd_pins mstrigger_0/rst] [get_bd_pins timer_0/rst] [get_bd_pins timestamp_1/rst]
connect_bd_net [get_bd_pins ctrl_reg1/Dout] [get_bd_pins timestamp_1/clear]
connect_bd_net [get_bd_pins ctrl_reg2/Dout] [get_bd_pins mstrigger_0/threshold]
connect_bd_net [get_bd_pins ctrl_reg] [get_bd_pins ctrl_reg/Din] [get_bd_pins ctrl_reg1/Din]
connect_bd_net [get_bd_pins din] [get_bd_pins FIFOMGR_0/ADC_DIN] [get_bd_pins mstrigger_0/din]
connect_bd_net [get_bd_pins fclk] [get_bd_pins FIFOMGR_0/CLK] [get_bd_pins mstrigger_0/clk] [get_bd_pins timer_0/fclk] [get_bd_pins timestamp_1/fclk]
connect_bd_net [get_bd_pins mstrigger_0/LAT] [get_bd_pins FIFOMGR_0/LT] [get_bd_pins timestamp_1/latency]
connect_bd_net [get_bd_pins mstrigger_0/TS] [get_bd_pins FIFOMGR_0/TS] [get_bd_pins timestamp_1/trig]
connect_bd_net [get_bd_pins sclk] [get_bd_pins timer_0/sclk] [get_bd_pins timestamp_1/sclk]
connect_bd_net [get_bd_pins threshold] [get_bd_pins ctrl_reg2/Din]
connect_bd_net [get_bd_pins timer_0/ft] [get_bd_pins FIFOMGR_0/TSF]
connect_bd_net [get_bd_pins timer_0/st] [get_bd_pins FIFOMGR_0/TSS]
connect_bd_net [get_bd_pins timestamp_1/trig_signal] [get_bd_pins trigger]
connect_bd_net [get_bd_pins timestamp_1/tsf] [get_bd_pins tsf]
connect_bd_net [get_bd_pins timestamp_1/tss] [get_bd_pins tss]
# net xlconcat_0_dout has one end: xlconcat_0/dout
# net xlconcat_1_dout has one end: xlconcat_1/dout
connect_bd_net -net xlslice_0_Dout [get_bd_pins ctrl_reg/Dout] [get_bd_pins mstrigger_0/en]

current_bd_instance /Processing_System
connect_bd_intf_net [get_bd_intf_pins processing_system7_0/M_AXI_GP0] [get_bd_intf_pins processing_system7_0_axi_periph/S00_AXI]
connect_bd_intf_net [get_bd_intf_pins DDR] [get_bd_intf_pins processing_system7_0/DDR]
connect_bd_intf_net [get_bd_intf_pins FIXED_IO] [get_bd_intf_pins processing_system7_0/FIXED_IO]
connect_bd_intf_net [get_bd_intf_pins IIC_0_0] [get_bd_intf_pins processing_system7_0/IIC_0]
connect_bd_intf_net [get_bd_intf_pins M00_AXI] [get_bd_intf_pins processing_system7_0_axi_periph/M00_AXI]
connect_bd_intf_net [get_bd_intf_pins M01_AXI] [get_bd_intf_pins processing_system7_0_axi_periph/M01_AXI]
connect_bd_intf_net [get_bd_intf_pins M02_AXI] [get_bd_intf_pins processing_system7_0_axi_periph/M02_AXI]
connect_bd_intf_net [get_bd_intf_pins M03_AXI] [get_bd_intf_pins processing_system7_0_axi_periph/M03_AXI]
connect_bd_intf_net [get_bd_intf_pins M04_AXI] [get_bd_intf_pins processing_system7_0_axi_periph/M04_AXI]
connect_bd_intf_net [get_bd_intf_pins M05_AXI] [get_bd_intf_pins processing_system7_0_axi_periph/M05_AXI]
connect_bd_intf_net [get_bd_intf_pins M06_AXI] [get_bd_intf_pins processing_system7_0_axi_periph/M06_AXI]
connect_bd_intf_net [get_bd_intf_pins M07_AXI] [get_bd_intf_pins processing_system7_0_axi_periph/M07_AXI]
connect_bd_intf_net [get_bd_intf_pins M08_AXI] [get_bd_intf_pins processing_system7_0_axi_periph/M08_AXI]
connect_bd_intf_net [get_bd_intf_pins M09_AXI] [get_bd_intf_pins processing_system7_0_axi_periph/M09_AXI]
connect_bd_intf_net -intf_net S_AXI_HP0_1 [get_bd_intf_pins S_AXI_HP0] [get_bd_intf_pins processing_system7_0/S_AXI_HP0]
connect_bd_intf_net [get_bd_intf_pins M10_AXI] [get_bd_intf_pins processing_system7_0_axi_periph/M10_AXI]
connect_bd_intf_net [get_bd_intf_pins M11_AXI] [get_bd_intf_pins processing_system7_0_axi_periph/M11_AXI]
connect_bd_net -net axi_dma_0_s2mm_introut [get_bd_pins IRQ_F2P] [get_bd_pins processing_system7_0/IRQ_F2P]
connect_bd_net [get_bd_pins proc_sys_reset_0/interconnect_aresetn] [get_bd_pins processing_system7_0_axi_periph/ARESETN]
connect_bd_net [get_bd_pins proc_sys_reset_0/peripheral_aresetn] \
  [get_bd_pins peripheral_aresetn] [get_bd_pins peripheral_aresetn1] \
  [get_bd_pins processing_system7_0_axi_periph/M00_ARESETN] [get_bd_pins processing_system7_0_axi_periph/M01_ARESETN] \
  [get_bd_pins processing_system7_0_axi_periph/M02_ARESETN] [get_bd_pins processing_system7_0_axi_periph/M03_ARESETN] \
  [get_bd_pins processing_system7_0_axi_periph/M04_ARESETN] [get_bd_pins processing_system7_0_axi_periph/M05_ARESETN] \
  [get_bd_pins processing_system7_0_axi_periph/M06_ARESETN] [get_bd_pins processing_system7_0_axi_periph/M07_ARESETN] \
  [get_bd_pins processing_system7_0_axi_periph/M08_ARESETN] [get_bd_pins processing_system7_0_axi_periph/M09_ARESETN] \
  [get_bd_pins processing_system7_0_axi_periph/S00_ARESETN] [get_bd_pins processing_system7_0_axi_periph/M10_ARESETN] \
  [get_bd_pins processing_system7_0_axi_periph/M11_ARESETN]
connect_bd_net [get_bd_pins processing_system7_0/FCLK_CLK0] \
  [get_bd_pins FCLK_CLK0] [get_bd_pins FCLK_CLK1] [get_bd_pins proc_sys_reset_0/slowest_sync_clk] \
  [get_bd_pins processing_system7_0/M_AXI_GP0_ACLK] [get_bd_pins processing_system7_0/S_AXI_HP0_ACLK] \
  [get_bd_pins processing_system7_0_axi_periph/ACLK] [get_bd_pins processing_system7_0_axi_periph/M00_ACLK] \
  [get_bd_pins processing_system7_0_axi_periph/M01_ACLK] [get_bd_pins processing_system7_0_axi_periph/M02_ACLK] \
  [get_bd_pins processing_system7_0_axi_periph/M03_ACLK] [get_bd_pins processing_system7_0_axi_periph/M04_ACLK] \
  [get_bd_pins processing_system7_0_axi_periph/M05_ACLK] [get_bd_pins processing_system7_0_axi_periph/M06_ACLK] \
  [get_bd_pins processing_system7_0_axi_periph/M07_ACLK] [get_bd_pins processing_system7_0_axi_periph/M08_ACLK] \
  [get_bd_pins processing_system7_0_axi_periph/M09_ACLK] [get_bd_pins processing_system7_0_axi_periph/S00_ACLK] \
  [get_bd_pins processing_system7_0_axi_periph/M10_ACLK] [get_bd_pins processing_system7_0_axi_periph/M11_ACLK]
connect_bd_net [get_bd_pins processing_system7_0/FCLK_RESET0_N] [get_bd_pins FCLK_RESET0_N] [get_bd_pins proc_sys_reset_0/ext_reset_in]

current_bd_instance /
connect_bd_intf_net [get_bd_intf_pins Comblock_PL/S_AXI_LITE] [get_bd_intf_pins Processing_System/M00_AXI]
connect_bd_intf_net [get_bd_intf_pins Comblock_PL/s00_axi] [get_bd_intf_pins Processing_System/M02_AXI]
connect_bd_intf_net [get_bd_intf_pins Processing_System/M07_AXI] [get_bd_intf_pins comblock_0/AXIL_REGS]
connect_bd_intf_net [get_bd_intf_pins Processing_System/M08_AXI] [get_bd_intf_pins comblock_0/AXIF_DRAM]
connect_bd_intf_net [get_bd_intf_pins Processing_System/M09_AXI] [get_bd_intf_pins comblock_0/AXIF_FIFO]
connect_bd_intf_net -intf_net S_AXI_HP0_1 [get_bd_intf_pins Comblock_PL/M00_AXI] [get_bd_intf_pins Processing_System/S_AXI_HP0]
connect_bd_intf_net [get_bd_intf_pins axi_uartlite_0/S_AXI] [get_bd_intf_pins Processing_System/M10_AXI]
connect_bd_intf_net [get_bd_intf_pins Fix/S_AXI] [get_bd_intf_pins Processing_System/M11_AXI]
connect_bd_intf_net -intf_net processing_system7_0_DDR [get_bd_intf_ports DDR] [get_bd_intf_pins Processing_System/DDR]
connect_bd_intf_net -intf_net processing_system7_0_FIXED_IO [get_bd_intf_ports FIXED_IO] [get_bd_intf_pins Processing_System/FIXED_IO]
connect_bd_intf_net [get_bd_intf_ports IIC0] [get_bd_intf_pins Processing_System/IIC_0_0]
connect_bd_intf_net [get_bd_intf_ports uart_rtl] [get_bd_intf_pins axi_uartlite_0/UART]
connect_bd_net [get_bd_pins ADC_Controller/Ctrl_reg_out] [get_bd_pins comblock_0/reg3_i]
connect_bd_net [get_bd_pins ADC_Controller/adc_raw] [get_bd_pins Comblock_PL/Din]
connect_bd_net [get_bd_pins ADC_Controller/clk_to_adc_DS_N] [get_bd_ports clk_to_adc_DS_N]
connect_bd_net [get_bd_pins ADC_Controller/clk_to_adc_DS_P] [get_bd_ports clk_to_adc_DS_P]
connect_bd_net [get_bd_pins ADC_Controller/x_to_adc_cal_fmc] [get_bd_ports x_to_adc_cal_fmc]
connect_bd_net [get_bd_pins ADC_Controller/x_to_adc_caldly_nscs_fmc] [get_bd_ports x_to_adc_caldly_nscs_fmc]
connect_bd_net [get_bd_pins ADC_Controller/x_to_adc_dclk_rst_fmc] [get_bd_ports x_to_adc_dclk_rst_fmc]
connect_bd_net [get_bd_pins ADC_Controller/x_to_adc_fsr_ece_fmc] [get_bd_ports x_to_adc_fsr_ece_fmc]
connect_bd_net [get_bd_pins ADC_Controller/x_to_adc_led_0] [get_bd_ports x_to_adc_led_0]
connect_bd_net [get_bd_pins ADC_Controller/x_to_adc_led_1] [get_bd_ports x_to_adc_led_1]
connect_bd_net [get_bd_pins ADC_Controller/x_to_adc_outedge_ddr_sdata_fmc] [get_bd_ports x_to_adc_outedge_ddr_sdata_fmc]
connect_bd_net [get_bd_pins ADC_Controller/x_to_adc_outv_slck_fmc] [get_bd_ports x_to_adc_outv_slck_fmc]
connect_bd_net [get_bd_pins ADC_Controller/x_to_adc_pd_fmc] [get_bd_ports x_to_adc_pd_fmc]
connect_bd_net -net CLK_1 [get_bd_pins util_ds_buf_1/BUFG_O] \
  [get_bd_pins comblock_0/fifo_clk_i] [get_bd_pins comblock_0/ram_clk_i] [get_bd_pins proc_sys_reset_1/slowest_sync_clk] \
  [get_bd_pins Comblock_PL/CLK]
connect_bd_net [get_bd_ports CLK_IN1_D_clk_n] [get_bd_pins util_ds_buf_0/IBUF_DS_N]
connect_bd_net [get_bd_ports CLK_IN1_D_clk_p] [get_bd_pins util_ds_buf_0/IBUF_DS_P]
connect_bd_net [get_bd_pins Comblock_PL/FIFO_CLR] [get_bd_pins comblock_0/fifo_clear_i]
connect_bd_net [get_bd_pins Comblock_PL/FIFO_DATA] [get_bd_pins comblock_0/fifo_data_i]
connect_bd_net [get_bd_pins Comblock_PL/FIFO_WE] [get_bd_pins comblock_0/fifo_we_i]
connect_bd_net [get_bd_pins Comblock_PL/addb_0] [get_bd_pins comblock_0/ram_addr_i]
connect_bd_net [get_bd_pins Comblock_PL/curr_cycle_0] [get_bd_pins comblock_0/reg4_i]
connect_bd_net [get_bd_pins Comblock_PL/dinb_0] [get_bd_pins comblock_0/ram_data_i]
connect_bd_net [get_bd_pins Comblock_PL/done_0] [get_bd_pins comblock_0/reg5_i]
connect_bd_net [get_bd_pins Comblock_PL/trigger] [get_bd_pins comblock_0/reg0_i]
connect_bd_net [get_bd_pins Comblock_PL/tsf] [get_bd_pins comblock_0/reg2_i]
connect_bd_net [get_bd_pins Comblock_PL/tss] [get_bd_pins comblock_0/reg1_i]
connect_bd_net [get_bd_pins Comblock_PL/web_0] [get_bd_pins comblock_0/ram_we_i]
connect_bd_net -net DAC_CTRL_0_RLED [get_bd_pins Comblock_PL/RLED_0] [get_bd_ports RLED_0]
connect_bd_net -net DAC_CTRL_0_SCK [get_bd_pins Comblock_PL/SCK_0] [get_bd_ports SCK_0]
connect_bd_net -net DAC_CTRL_0_SDATA [get_bd_pins Comblock_PL/SDATA_0] [get_bd_ports SDATA_0]
connect_bd_net -net DAC_CTRL_0_SS [get_bd_pins Comblock_PL/SS_0] [get_bd_ports SS_0]
connect_bd_net -net IRQ_F2P_1 [get_bd_pins Comblock_PL/s2mm_introut] [get_bd_pins Processing_System/IRQ_F2P]
connect_bd_net [get_bd_pins Processing_System/FCLK_CLK0] \
  [get_bd_pins comblock_0/axif_dram_aclk] [get_bd_pins comblock_0/axif_fifo_aclk] [get_bd_pins comblock_0/axil_regs_aclk]
connect_bd_net [get_bd_pins Processing_System/FCLK_CLK1] \
  [get_bd_pins axi_uartlite_0/s_axi_aclk] [get_bd_pins Fix/s_axi_aclk] [get_bd_pins Comblock_PL/m_axi_s2mm_aclk]
connect_bd_net [get_bd_pins Processing_System/FCLK_RESET0_N] [get_bd_pins proc_sys_reset_1/ext_reset_in]
connect_bd_net [get_bd_pins Processing_System/peripheral_aresetn1] \
  [get_bd_pins comblock_0/axif_dram_aresetn] [get_bd_pins comblock_0/axif_fifo_aresetn] \
  [get_bd_pins comblock_0/axil_regs_aresetn] [get_bd_pins axi_uartlite_0/s_axi_aresetn] [get_bd_pins Fix/s_axi_aresetn]
connect_bd_net [get_bd_pins comblock_0/fifo_aempty_o] [get_bd_pins Comblock_PL/FIFO_AEMPTY]
connect_bd_net [get_bd_pins comblock_0/fifo_afull_o] [get_bd_pins Comblock_PL/FIFO_AFULL]
connect_bd_net [get_bd_pins comblock_0/fifo_empty_o] [get_bd_pins Comblock_PL/FIFO_EMPTY]
connect_bd_net [get_bd_pins comblock_0/fifo_full_o] [get_bd_pins Comblock_PL/FIFO_FULL]
connect_bd_net [get_bd_pins comblock_0/ram_data_o] [get_bd_pins Comblock_PL/doutb_0]
connect_bd_net [get_bd_pins comblock_0/reg0_o] [get_bd_pins Comblock_PL/threshold]
connect_bd_net [get_bd_pins comblock_0/reg10_o] [get_bd_pins Comblock_PL/FIFOMGR_CTRL_REG]
connect_bd_net [get_bd_pins comblock_0/reg11_o] [get_bd_pins Comblock_PL/In0]
connect_bd_net [get_bd_pins comblock_0/reg12_o] [get_bd_pins Comblock_PL/In1]
connect_bd_net [get_bd_pins comblock_0/reg13_o] [get_bd_pins Comblock_PL/In2]
connect_bd_net [get_bd_pins comblock_0/reg14_o] [get_bd_pins Comblock_PL/In3]
connect_bd_net [get_bd_pins comblock_0/reg1_o] [get_bd_pins Comblock_PL/ctrl_reg]
connect_bd_net [get_bd_pins comblock_0/reg2_o] [get_bd_pins Comblock_PL/n]
connect_bd_net [get_bd_pins comblock_0/reg3_o] [get_bd_pins Comblock_PL/N1]
connect_bd_net [get_bd_pins comblock_0/reg4_o] [get_bd_pins Comblock_PL/DATA]
connect_bd_net [get_bd_pins comblock_0/reg5_o] [get_bd_pins Comblock_PL/CTRL]
connect_bd_net [get_bd_pins comblock_0/reg6_o] [get_bd_pins Comblock_PL/DEVICE]
connect_bd_net [get_bd_pins comblock_0/reg7_o] [get_bd_pins ADC_Controller/Ctrl_reg_in]
connect_bd_net [get_bd_pins comblock_0/reg8_o] [get_bd_pins Comblock_PL/ctrl_reg_0]
connect_bd_net [get_bd_pins comblock_0/reg9_o] [get_bd_pins Comblock_PL/max_cycles_0]
connect_bd_net [get_bd_ports data_from_adc_DS_N] [get_bd_pins ADC_Controller/data_from_adc_DS_N]
connect_bd_net [get_bd_ports data_from_adc_DS_P] [get_bd_pins ADC_Controller/data_from_adc_DS_P]
connect_bd_net [get_bd_ports from_adc_or_DS_N] [get_bd_pins ADC_Controller/from_adc_or_DS_N]
connect_bd_net [get_bd_ports from_adc_or_DS_P] [get_bd_pins ADC_Controller/from_adc_or_DS_P]
connect_bd_net -net proc_sys_reset_0_peripheral_aresetn [get_bd_pins Processing_System/peripheral_aresetn] \
  [get_bd_pins ADC_Controller/s00_axi_aresetn1] [get_bd_pins Comblock_PL/s00_axi_aresetn1]
connect_bd_net [get_bd_pins proc_sys_reset_1/peripheral_aresetn] [get_bd_ports rtc_rst] [get_bd_pins Comblock_PL/RST]
connect_bd_net [get_bd_pins util_ds_buf_0/IBUF_OUT] [get_bd_pins util_ds_buf_1/BUFG_I]
connect_bd_net [get_bd_ports x_from_adc_calrun_fmc] [get_bd_pins ADC_Controller/x_from_adc_calrun_fmc]
connect_bd_net [get_bd_pins GPS_EN_0/Fix] [get_bd_pins Fix/gpio_io_i]
connect_bd_net [get_bd_pins GPS_EN_0/PPSOut] [get_bd_pins Comblock_PL/rtc_1hz]
connect_bd_net -net PPSIn_0_1 [get_bd_ports PPSIn_0] [get_bd_pins GPS_EN_0/PPSIn]
connect_bd_net [get_bd_pins clk_wiz_0/clk_out1] [get_bd_pins GPS_EN_0/CLK]
connect_bd_net [get_bd_ports sys_clock] [get_bd_pins clk_wiz_0/clk_in1]
connect_bd_net [get_bd_pins clk_wiz_0/clk_out2] [get_bd_pins ADC_Controller/clk_in1]

# ---- address map ----
assign_bd_address -offset 0x00000000 -range 512M -target_address_space [get_bd_addr_spaces Comblock_PL/DMA_Osciloscope/axi_dma_0/Data_S2MM] [get_bd_addr_segs Processing_System/processing_system7_0/S_AXI_HP0/HP0_DDR_LOWOCM]
assign_bd_address -offset 0x40400000 -range 64K -target_address_space [get_bd_addr_spaces Processing_System/processing_system7_0/Data] [get_bd_addr_segs Comblock_PL/DMA_Osciloscope/axi_dma_0/S_AXI_LITE/Reg]
assign_bd_address -offset 0x41200000 -range 64K -target_address_space [get_bd_addr_spaces Processing_System/processing_system7_0/Data] [get_bd_addr_segs Fix/S_AXI/Reg]
assign_bd_address -offset 0x42C00000 -range 64K -target_address_space [get_bd_addr_spaces Processing_System/processing_system7_0/Data] [get_bd_addr_segs axi_uartlite_0/S_AXI/Reg]
assign_bd_address -offset 0x43C00000 -range 64K -target_address_space [get_bd_addr_spaces Processing_System/processing_system7_0/Data] [get_bd_addr_segs Comblock_PL/DMA_Osciloscope/AXI_Trigger_gen_m4_0/s00_axi/reg0]
assign_bd_address -offset 0x43C30000 -range 64K -target_address_space [get_bd_addr_spaces Processing_System/processing_system7_0/Data] [get_bd_addr_segs comblock_0/AXIL_REGS/AXIL_REGS_reg]
assign_bd_address -offset 0x7AA00000 -range 64K -target_address_space [get_bd_addr_spaces Processing_System/processing_system7_0/Data] [get_bd_addr_segs comblock_0/AXIF_DRAM/AXIF_DRAM_mem]
assign_bd_address -offset 0x7AA10000 -range 64K -target_address_space [get_bd_addr_spaces Processing_System/processing_system7_0/Data] [get_bd_addr_segs comblock_0/AXIF_FIFO/AXIF_FIFO_mem]

validate_bd_design
save_bd_design
